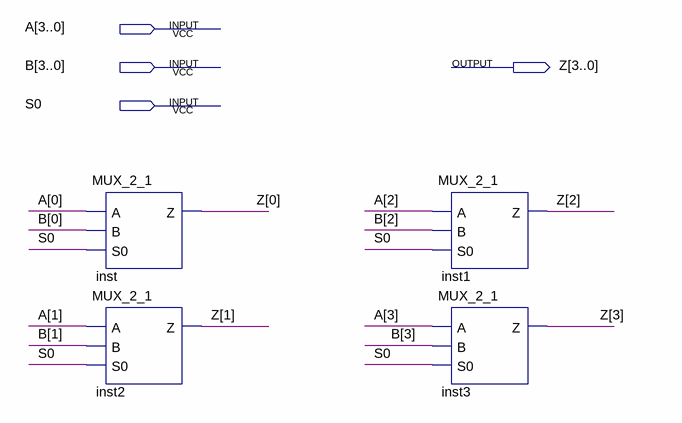
[diagram p0: schematic sheet]
// Quartus schematic MUX_4_1.bdf as structural Verilog: 4 symbols, 4 pins
module MUX_4_1 (
  input  [3:0] A,
  input  [3:0] B,
  input  S0,
  output [3:0] Z
);

  MUX_2_1 inst (.A(A[0]), .B(B[0]), .S0(S0), .Z(Z[0]));
  MUX_2_1 inst2 (.A(A[1]), .B(B[1]), .S0(S0), .Z(Z[1]));
  MUX_2_1 inst1 (.A(A[2]), .B(B[2]), .S0(S0), .Z(Z[2]));
  MUX_2_1 inst3 (.A(A[3]), .B(B[3]), .S0(S0), .Z(Z[3]));
endmodule
